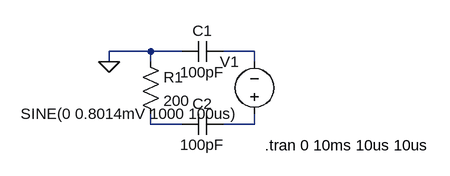
[diagram p0: schematic Draft1.asc]
Draft1.asc, the LTspice schematic file:
Version 4
SHEET 1 880 680
WIRE 96 96 32 96
WIRE 144 96 96 96
WIRE 256 96 208 96
WIRE 32 112 32 96
WIRE 96 112 96 96
WIRE 256 112 256 96
WIRE 96 208 96 192
WIRE 144 208 96 208
WIRE 256 208 256 192
WIRE 256 208 208 208
FLAG 32 112 0
SYMBOL cap 208 80 R90
WINDOW 0 0 32 VBottom 2
WINDOW 3 32 32 VTop 2
SYMATTR InstName C1
SYMATTR Value 100pF
SYMBOL cap 208 192 R90
WINDOW 0 0 32 VBottom 2
WINDOW 3 32 32 VTop 2
SYMATTR InstName C2
SYMATTR Value 100pF
SYMBOL res 80 96 R0
SYMATTR InstName R1
SYMATTR Value 200
SYMBOL voltage 256 208 R180
WINDOW 0 24 96 Left 2
WINDOW 3 24 16 Left 2
WINDOW 123 0 0 Left 2
WINDOW 39 0 0 Left 2
SYMATTR InstName V1
SYMATTR Value SINE(0 0.8014mV 1000 100us)
TEXT 272 240 Left 2 !.tran 0 10ms 10us 10us

The netlist it stands for:
* Draft1.asc
C1 N001 0 100pF
C2 N003 N002 100pF
R1 0 N002 200
V1 N003 N001 SINE(0 0.8014mV 1000 100us)
.tran 0 10ms 10us 10us
.backanno
.end